# EAGLE design YM2151ShieldR3 (EAGLE 5.08)
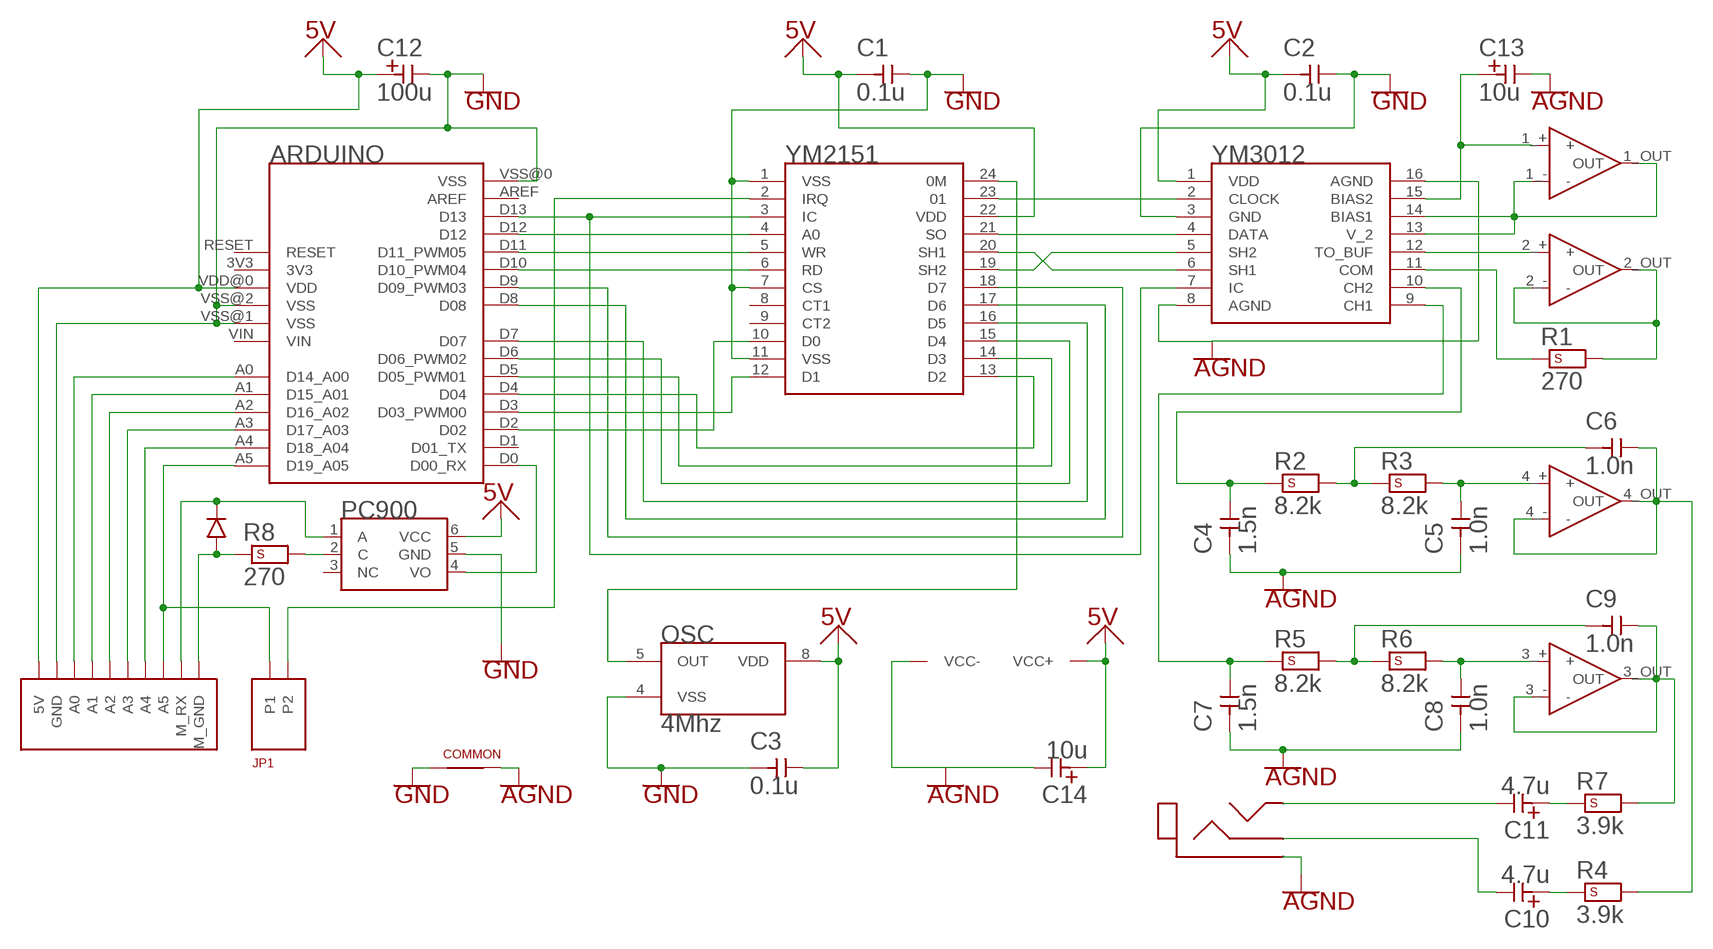
[diagram p0: schematic, sheet 1]

## Parts
ARDUINO  ARDUINO_DEV  [ARDUINO_PAC]
C1  0.1u  CAPACITOR_LEAD_DEV  [CAPACITOR_LEAD_PAC]
C2  0.1u  CAPACITOR_LEAD_DEV  [CAPACITOR_LEAD_PAC]
C3  0.1u  CAPACITOR_LEAD_DEV  [CAPACITOR_LEAD_PAC]
C4  1.5n  CAPACITOR_LEAD_DEV  [CAPACITOR_LEAD_PAC]
C5  1.0n  CAPACITOR_LEAD_DEV  [CAPACITOR_LEAD_PAC]
C6  1.0n  CAPACITOR_LEAD_DEV  [CAPACITOR_LEAD_PAC]
C7  1.5n  CAPACITOR_LEAD_DEV  [CAPACITOR_LEAD_PAC]
C8  1.0n  CAPACITOR_LEAD_DEV  [CAPACITOR_LEAD_PAC]
C9  1.0n  CAPACITOR_LEAD_DEV  [CAPACITOR_LEAD_PAC]
C10  4.7u  CAPACITOR_P_LEAD_DEV  [CAPACITOR_P_LEAD_PAC]
C11  4.7u  CAPACITOR_P_LEAD_DEV  [CAPACITOR_P_LEAD_PAC]
C12  100u  CAPACITOR_P_2MM_LEAD_DEV  [CAPACITOR_P_2MM_LEAD_PAC]
C13  10u  CAPACITOR_P_2MM_LEAD_DEV  [CAPACITOR_P_2MM_LEAD_PAC]
C14  10u  CAPACITOR_P_2MM_LEAD_DEV  [CAPACITOR_P_2MM_LEAD_PAC]
JP1  2PHEADER_DEV  [2PHEADER_PAC]
OPAMP  OPAMP4_DEV  [OPAMP4_PAC]
OSC  4Mhz  OSC_DEV  [OSC_PAC]
PC900  PC900V_DEV  [PC900V_PAC]
R1  270  RESISTER_V_SML_LEAD_DEV  [RESISTER_V_SML_LEAD_PAC]
R2  8.2k  RESISTER_V_SML_LEAD_DEV  [RESISTER_V_SML_LEAD_PAC]
R3  8.2k  RESISTER_V_SML_LEAD_DEV  [RESISTER_V_SML_LEAD_PAC]
R4  3.9k  RESISTER_V_SML_LEAD_DEV  [RESISTER_V_SML_LEAD_PAC]
R5  8.2k  RESISTER_V_SML_LEAD_DEV  [RESISTER_V_SML_LEAD_PAC]
R6  8.2k  RESISTER_V_SML_LEAD_DEV  [RESISTER_V_SML_LEAD_PAC]
R7  3.9k  RESISTER_V_SML_LEAD_DEV  [RESISTER_V_SML_LEAD_PAC]
R8  270  RESISTER_V_SML_LEAD_DEV  [RESISTER_V_SML_LEAD_PAC]
U$5  10PHEADER_DEV  [10PHEADER_PAC]
U$8  1S1588_DEV  [1S1588_PAC]
U$13  BTMBRIDGE_DEV  [BTMBRIDGE_PAC]
U$21  MINI_SW_DEV  [MINI_SW_PAC]
YM2151  YM2151DEV  [YM2151PAC]
YM3012  YM3012_DEV  [YM3012_PAC]

## Nets
5V [5V]: ARDUINO.VDD@0(VDD) C1.P$1 C2.P$1 C3.P$2 C12.P C14.P OPAMP.VCC+ OSC.8(VDD) PC900.6(VCC) U$5.P$1(5V) YM2151.22(VDD) YM3012.1(VDD)
AGND [AGND]: C4.P$1 C5.P$1 C7.P$1 C8.P$1 C13.N C14.N OPAMP.VCC- U$13.P$2 U$21.1(AGND) YM3012.8(AGND) YM3012.16(AGND)
GND [GND]: ARDUINO.VSS@0(VSS) ARDUINO.VSS@1(VSS) ARDUINO.VSS@2(VSS) C1.P$2 C2.P$2 C3.P$1 C12.N OSC.4(VSS) PC900.5(GND) U$5.P$2(GND) U$13.P$1 YM2151.1(VSS) YM2151.7(CS) YM2151.11(VSS) YM3012.3(GND)
M_GND: R8.P$1 U$5.P$10(M_GND) U$8.P$1
N$1: ARDUINO.D3(D03_PWM00) YM2151.12(D1)
N$2: ARDUINO.D2(D02) YM2151.10(D0)
N$3: ARDUINO.D4(D04) YM2151.13(D2)
N$4: ARDUINO.D5(D05_PWM01) YM2151.14(D3)
N$5: ARDUINO.D6(D06_PWM02) YM2151.15(D4)
N$6: ARDUINO.D7(D07) YM2151.16(D5)
N$7: ARDUINO.D8(D08) YM2151.17(D6)
N$8: ARDUINO.D9(D09_PWM03) YM2151.18(D7)
N$9: ARDUINO.D10(D10_PWM04) YM2151.6(RD)
N$10: ARDUINO.D11(D11_PWM05) YM2151.5(WR)
N$11: ARDUINO.D12 YM2151.4(A0)
N$12: ARDUINO.D13 YM2151.3(IC) YM3012.7(IC)
N$13: YM2151.20(SH1) YM3012.6(SH1)
N$14: YM2151.19(SH2) YM3012.5(SH2)
N$15: YM2151.21(SO) YM3012.4(DATA)
N$16: YM2151.23 YM3012.2(CLOCK)
N$17: ARDUINO.A5(D19_A05) JP1.1 U$5.P$8(A5)
N$18: ARDUINO.A4(D18_A04) U$5.P$7(A4)
N$19: ARDUINO.A3(D17_A03) U$5.P$6(A3)
N$20: ARDUINO.A2(D16_A02) U$5.P$5(A2)
N$21: ARDUINO.A1(D15_A01) U$5.P$4(A1)
N$22: ARDUINO.A0(D14_A00) U$5.P$3(A0)
N$23: JP1.2 YM2151.2(IRQ)
N$24: PC900.2(C) R8.P$2
N$25: PC900.1(A) U$5.P$9(M_RX) U$8.P$2
N$26: ARDUINO.D0(D00_RX) PC900.4(VO)
N$27 [5V]: C13.P OPAMP.1_+(+) YM3012.15(BIAS2)
N$28 [5V]: C7.P$2 R5.P$1 YM3012.9(CH1)
N$29 [5V]: OPAMP.1_-(-) OPAMP.1_OUT(OUT) YM3012.13(V_2) YM3012.14(BIAS1)
N$30 [5V]: R1.P$1 YM3012.11(COM)
N$31 [5V]: OPAMP.2_+(+) YM3012.12(TO_BUF)
N$32 [5V]: OPAMP.2_-(-) OPAMP.2_OUT(OUT) R1.P$2
N$33 [5V]: C4.P$2 R2.P$1 YM3012.10(CH2)
N$34: C9.P$2 OPAMP.3_-(-) OPAMP.3_OUT(OUT) R7.P$2
N$35 [5V]: C11.P R7.P$1
N$36 [5V]: C6.P$1 R2.P$2 R3.P$1
N$37 [5V]: C9.P$1 R5.P$2 R6.P$1
N$38 [5V]: C8.P$2 OPAMP.3_+(+) R6.P$2
N$39 [5V]: C10.N U$21.2(R)
N$40 [5V]: C5.P$2 OPAMP.4_+(+) R3.P$2
N$41 [5V]: C11.N U$21.5(L)
N$42 [5V]: OSC.5(OUT) YM2151.24(0M)
N$43 [5V]: C10.P R4.P$1
N$44 [5V]: C6.P$2 OPAMP.4_-(-) OPAMP.4_OUT(OUT) R4.P$2
Unconnected: ARDUINO.AREF ARDUINO.D1(D01_TX) ARDUINO.RESET ARDUINO.VIN PC900.3(NC) YM2151.8(CT1) YM2151.9(CT2)

## Power pins joined to a net without a drawn wire
3V3: ARDUINO.3V3

## Library data of the parts
ARDUINO = arduino:ARDUINO_DEV
C1-C9 = CAPACITOR_LEAD:CAPACITOR_LEAD_DEV
C10 C11 = CAPACITOR_P_LEAD:CAPACITOR_P_LEAD_DEV
C12-C14 = CAPACITOR_P_LEAD:CAPACITOR_P_2MM_LEAD_DEV
JP1 = PINHEADER:2PHEADER_DEV
OPAMP = OPAMP:OPAMP4_DEV
OSC = OSC_HALF:OSC_DEV
PC900 = Photocoupler:PC900V_DEV
R1-R8 = RESISTER_H_LEAD:RESISTER_V_SML_LEAD_DEV
U$5 = PINHEADER:10PHEADER_DEV
U$8 = Diode:1S1588_DEV
U$13 = POWER:BTMBRIDGE_DEV
U$21 = MINI_SW:MINI_SW_DEV
YM2151 = YM2151:YM2151DEV
YM3012 = YM3012:YM3012_DEV

## Board
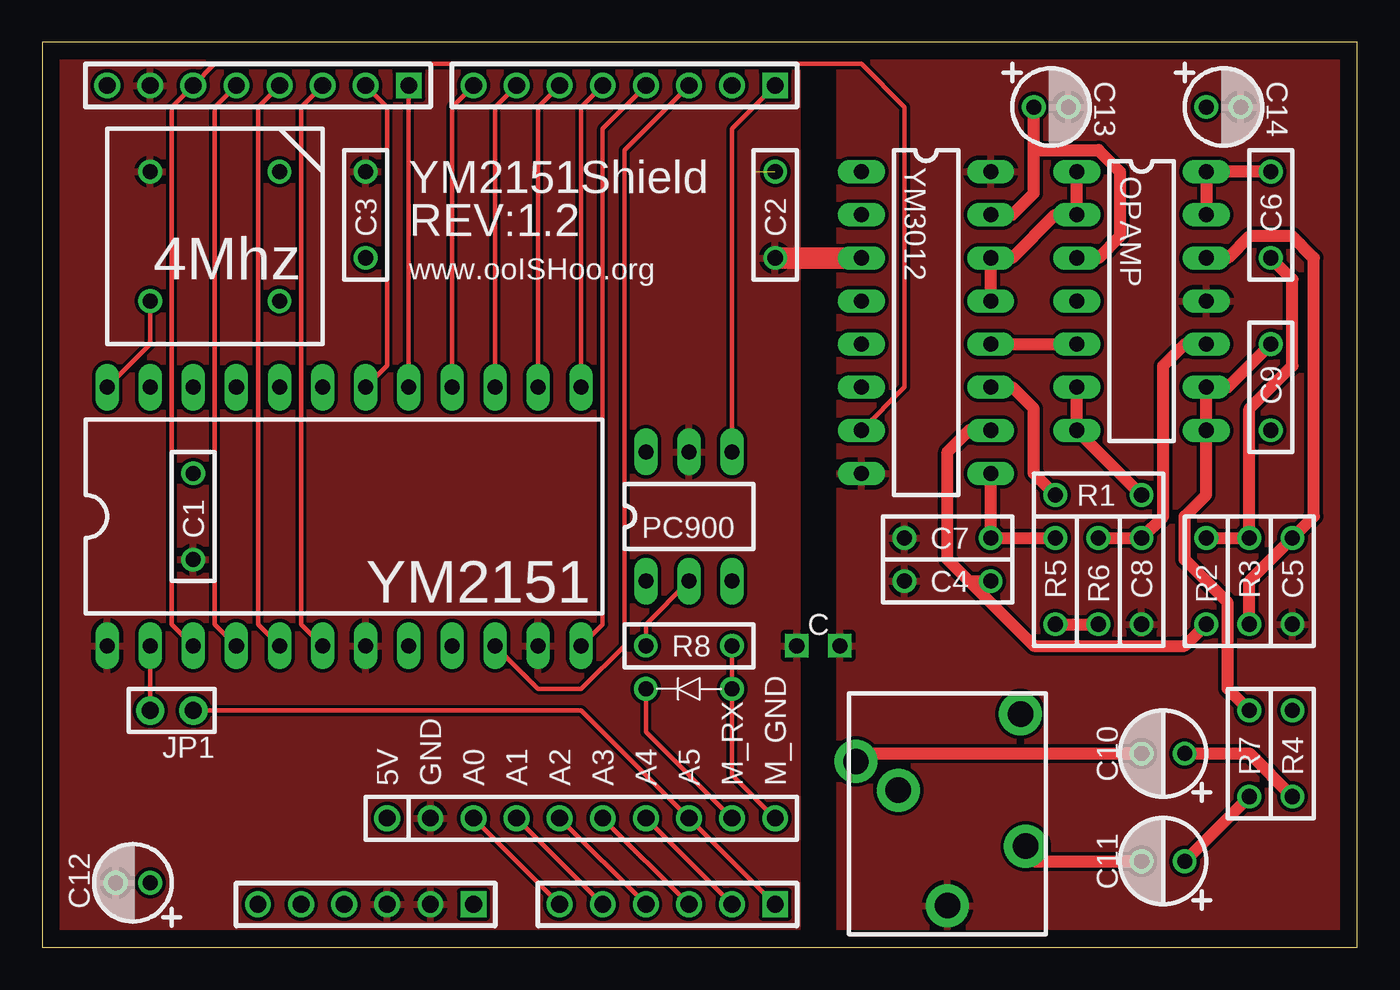
[diagram p1: board, top side]
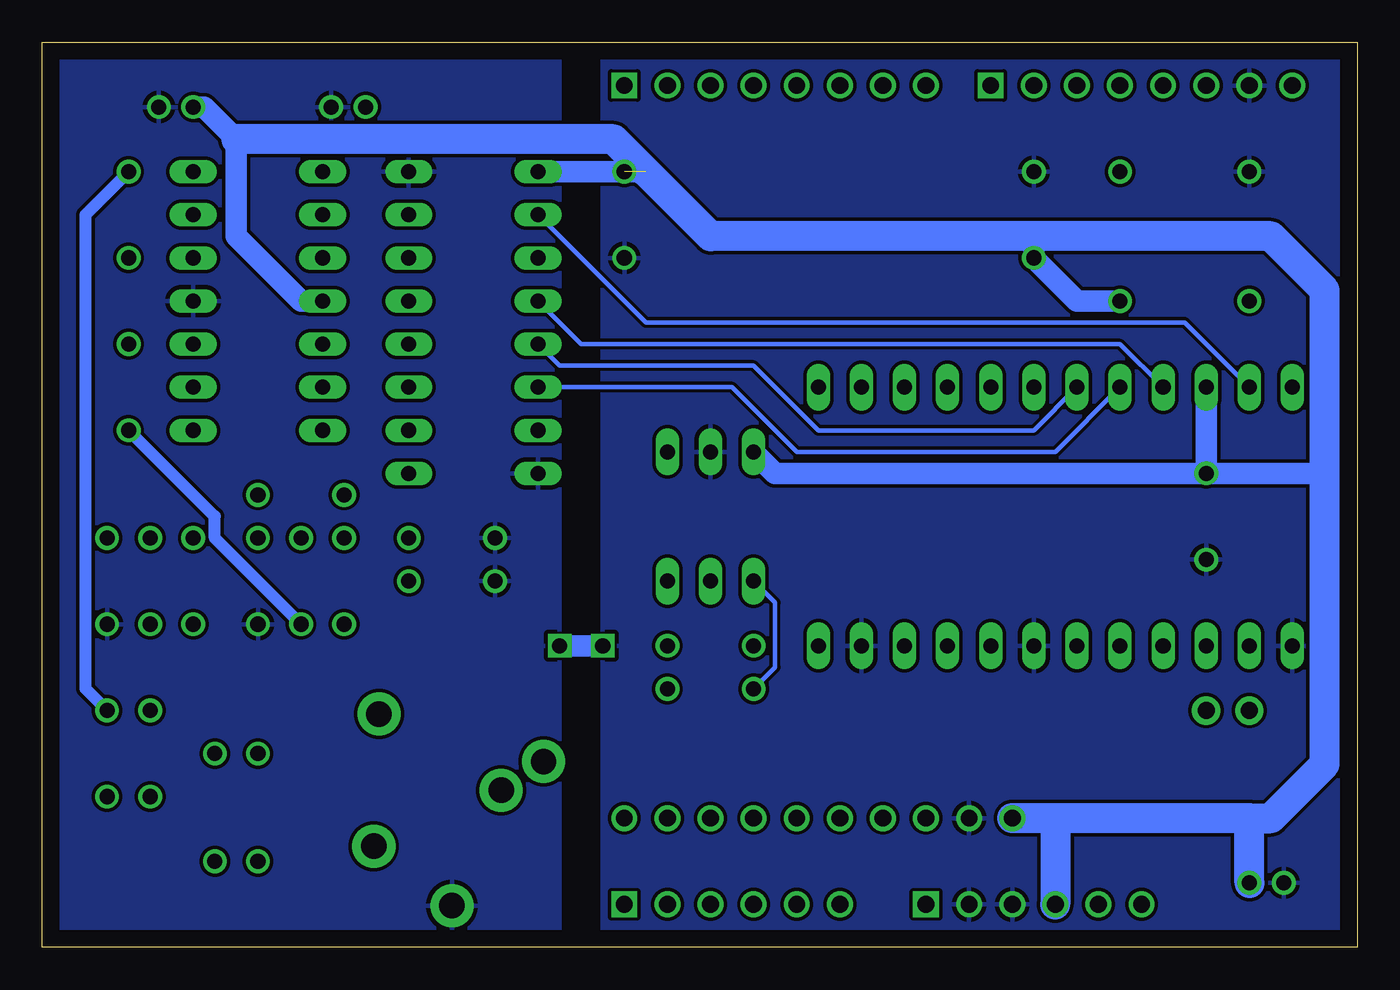
[diagram p2: board, bottom side, seen from below]

Size 77.47 x 53.34 mm. Coordinates in mm from the lower left corner, seen from the top.
Outline: 0,0 77.47,0 77.47,53.34 0,53.34 0,0
Copper layers (1*16): Top 0.035mm / dielectric 1.5mm / Bottom 0.035mm
Design rules "default": minimum track width 10mil, minimum drill 24mil, track to track 8mil, track to pad 8mil, pad to pad 8mil, via to via 8mil, smd to smd 8mil, copper to edge 40mil, drill to drill 8mil, minimum pad ring 10mil, minimum via ring 8mil, stop-mask expansion 4mil, vias tented up to drill 0mil, thermal gap 10mil

### Footprints (pad centres in the part's own frame; a part is rotated, then mirrored left to right if it is on the bottom)
ARDUINO_PAC = drill 0.991 pad 1.524 round: 3V3 -48.26,-15.24; A0 -48.26,-30.48; A1 -48.26,-33.02; A2 -48.26,-35.56; A3 -48.26,-38.1; A4 -48.26,-40.64; AREF 0,-3.81; D1 0,-40.64; D2 0,-38.1; D3 0,-35.56; D4 0,-33.02; D5 0,-30.48; D6 0,-27.94; D7 0,-25.4; D9 0,-19.05; D10 0,-16.51; D11 0,-13.97; D12 0,-11.43; D13 0,-8.89; RESET -48.26,-12.7; VDD@0 -48.26,-17.78; VSS@0 0,-6.35; VSS@1 -48.26,-22.86; VSS@2 -48.26,-20.32 | drill 0.991 pad 1.524 square: A5 -48.26,-43.18; D0 0,-43.18; D8 0,-21.59; VIN -48.26,-25.4
CAPACITOR_LEAD_PAC = drill 0.889 pad 1.372 round: P$1 1.27,-1.27; P$2 6.35,-1.27
CAPACITOR_P_LEAD_PAC = drill 0.889 pad 1.372 round: N 0,0; P -2.54,0
CAPACITOR_P_2MM_LEAD_PAC = drill 0.889 pad 1.372 round: N 2.032,0; P 0,0
2PHEADER_PAC = drill 0.991 pad 1.676 round: 1 0,0; 2 2.54,0
OPAMP4_PAC = drill 0.889 pad 1.372 long: 1_+ 0,-7.62; 1_- 0,-5.08; 1_OUT 0,-2.54; 2_+ 0,-12.7; 2_- 0,-15.24; 2_OUT 0,-17.78; 3_+ 7.62,-12.7; 3_- 7.62,-15.24; 3_OUT 7.62,-17.78; 4_+ 7.62,-7.62; 4_- 7.62,-5.08; 4_OUT 7.62,-2.54; VCC+ 0,-10.16; VCC- 7.62,-10.16
OSC_PAC = drill 0.889 pad 1.372 round: 1 2.54,0; 4 10.16,0; 5 10.16,7.62; 8 2.54,7.62
PC900V_PAC = drill 0.889 pad 1.372 long: 1 -3.81,2.54; 2 -3.81,0; 3 -3.81,-2.54; 4 3.81,-2.54; 5 3.81,0; 6 3.81,2.54
RESISTER_V_SML_LEAD_PAC = drill 0.889 pad 1.372 round: P$1 2.54,0; P$2 -2.54,0
10PHEADER_PAC = drill 0.991 pad 1.524 round: P$1 2.54,0; P$2 5.08,0; P$3 7.62,0; P$4 10.16,0; P$5 12.7,0; P$6 15.24,0; P$7 17.78,0; P$8 20.32,0; P$9 22.86,0; P$10 25.4,0
1S1588_PAC = drill 0.889 pad 1.372 round: P$1 -2.54,0; P$2 2.54,0
BTMBRIDGE_PAC = drill 0.889 pad 1.372 square: P$1 -1.27,0; P$2 1.27,0
MINI_SW_PAC = drill 1.5 pad 2.54 round: 1 -2.97,-6.35; 2 -11.47,-11.75; 3 -9.77,-9.25; 4 -14.27,-2.05; 5 -6.47,-1.75
YM2151PAC = drill 0.889 pad 1.372 long: 1 0,-2.54; 2 0,-5.08; 3 0,-7.62; 4 0,-10.16; 5 0,-12.7; 6 0,-15.24; 7 0,-17.78; 8 0,-20.32; 9 0,-22.86; 10 0,-25.4; 11 0,-27.94; 12 0,-30.48; 13 15.24,-30.48; 14 15.24,-27.94; 15 15.24,-25.4; 16 15.24,-22.86; 17 15.24,-20.32; 18 15.24,-17.78; 19 15.24,-15.24; 20 15.24,-12.7; 21 15.24,-10.16; 22 15.24,-7.62; 23 15.24,-5.08; 24 15.24,-2.54
YM3012_PAC = drill 0.889 pad 1.372 long: 1 0,-2.54; 2 0,-5.08; 3 0,-7.62; 4 0,-10.16; 5 0,-12.7; 6 0,-15.24; 7 0,-17.78; 8 0,-20.32; 9 7.62,-20.32; 10 7.62,-17.78; 11 7.62,-15.24; 12 7.62,-12.7; 13 7.62,-10.16; 14 7.62,-7.62; 15 7.62,-5.08; 16 7.62,-2.54

### Placement (x,y rotation side)
ARDUINO  0,50.8 90 top
C1  10.16,29.21 270 top
C2  44.45,46.99 270 top
C3  20.32,46.99 270 top
C4  49.53,22.86 0 top
C5  72.39,17.78 90 top
C6  71.12,39.37 90 top
C7  49.53,25.4 0 top
C8  63.5,17.78 90 top
C9  71.12,29.21 90 top
C10  64.77,11.43 180 top
C11  64.77,5.08 180 top
C12  6.35,3.81 180 top
C13  58.42,49.53 0 top
C14  68.58,49.53 0 top
JP1  8.89,13.97 180 top
OPAMP  60.96,48.26 0 top
OSC  16.51,45.72 180 top
PC900  38.1,25.4 90 top
R1  62.23,26.67 180 top
R2  68.58,21.59 270 top
R3  71.12,21.59 90 top
R4  73.66,11.43 270 top
R5  59.69,21.59 90 top
R6  62.23,21.59 270 top
R7  71.12,11.43 270 top
R8  38.1,17.78 0 top
U$5  17.78,7.62 0 top
U$8  38.1,15.24 180 top
U$13  45.72,17.78 0 top
U$21  59.69,-0.51 270 top
YM2151  1.27,17.78 90 top
YM3012  48.26,48.26 0 top

### Tracks (layer width: path | path; a pad name or v marks a point on that pad's centre or on a via)
5V  (1 unrouted)
  Bottom 1.27: OPAMP.VCC+ 62.23,38.1 66.04,41.91 66.04,47.62 67.94,49.53 C14.P | 41.91,45.72 YM3012.1 | OSC.8 16.51,38.1 C3.P$2 19.05,41.91 | PC900.6 34.29,27.94 C1.P$1 | C1.P$1 YM2151.22 | 1.91,27.94 C1.P$1
  Bottom 1.778: 66.04,47.62 43.81,47.62 41.91,45.72 38.1,41.91 19.05,41.91 5.08,41.91 1.91,38.73 1.91,27.94 1.91,10.79 5.08,7.62 6.35,7.62 | 17.78,7.62 U$5.P$1 | 17.78,7.62 ARDUINO.VDD@0 | 6.35,7.62 17.78,7.62 | C12.P 6.35,7.62
AGND
  pour Top: 46.99,53.34 77.47,53.34 77.47,0 46.99,0
  pour Bottom: 46.99,53.34 77.47,53.34 77.47,0 46.99,0
GND
  Top 1.27: C2.P$2 YM3012.3
  pour Top: 0,53.34 44.45,53.34 44.45,0 0,0
  pour Bottom: 0,53.34 44.45,53.34 44.45,0 0,0
M_GND
  Top 0.254: R8.P$1 U$8.P$1 40.64,10.16 U$5.P$10
N$1
  Top 0.254: YM2151.12 33.02,19.05 33.02,48.26 ARDUINO.D3
N$2
  Top 0.254: YM2151.10 29.21,15.24 31.75,15.24 34.29,17.78 34.29,46.99 ARDUINO.D2
N$3
  Top 0.254: YM2151.13 31.75,49.53 ARDUINO.D4
N$4
  Top 0.254: YM2151.14 29.21,49.53 ARDUINO.D5
N$5
  Top 0.254: YM2151.15 26.67,49.53 ARDUINO.D6
N$6
  Top 0.254: YM2151.16 24.13,49.53 ARDUINO.D7
N$7
  Top 0.254: YM2151.17 ARDUINO.D8
N$8
  Top 0.254: ARDUINO.D9 20.32,49.53 20.32,34.29 YM2151.18
N$9
  Top 0.254: YM2151.6 15.24,19.05 15.24,49.53 ARDUINO.D10
N$10
  Top 0.254: YM2151.5 12.7,19.05 12.7,49.53 ARDUINO.D11
N$11
  Top 0.254: YM2151.4 10.16,19.05 10.16,49.53 ARDUINO.D12
N$12
  Top 0.254: YM2151.3 7.62,19.05 7.62,49.53 ARDUINO.D13 10.16,52.07 48.26,52.07 50.8,49.53 50.8,33.02 YM3012.7
N$13
  Bottom 0.254: YM2151.20 17.78,29.21 33.02,29.21 36.83,33.02 YM3012.6
N$14
  Bottom 0.254: YM2151.19 19.05,30.48 31.75,30.48 35.56,34.29 46.99,34.29 YM3012.5
N$15
  Bottom 0.254: YM2151.21 13.97,35.56 45.72,35.56 YM3012.4
N$16
  Bottom 0.254: YM3012.2 41.91,36.83 10.16,36.83 YM2151.23
N$17
  Top 0.254: ARDUINO.A5 U$5.P$8 31.75,13.97 JP1.1
N$18
  Top 0.254: ARDUINO.A4 U$5.P$7
N$19
  Top 0.254: ARDUINO.A3 U$5.P$6
N$20
  Top 0.254: ARDUINO.A2 U$5.P$5
N$21
  Top 0.254: ARDUINO.A1 U$5.P$4
N$22
  Top 0.254: ARDUINO.A0 U$5.P$3
N$23
  Top 0.254: JP1.2 YM2151.2
N$24
  Top 0.254: R8.P$2 35.56,19.05 PC900.2
N$25
  Top 0.254: U$5.P$9 35.56,12.7 U$8.P$2
  Bottom 0.254: U$8.P$2 34.29,16.51 34.29,20.32 PC900.1
N$26
  Top 0.254: PC900.4 40.64,48.26 ARDUINO.D0
N$27
  Top 0.711: YM3012.15 57.15,43.18 58.42,44.45 58.42,46.99 | 58.42,46.99 C13.P | 58.42,46.99 62.23,46.99 63.5,45.72 63.5,41.91 62.23,40.64 OPAMP.1_+
N$28
  Top 0.711: YM3012.9 C7.P$2 R5.P$1
N$29
  Top 0.711: OPAMP.1_OUT OPAMP.1_- 59.69,43.18 57.15,40.64 YM3012.14 YM3012.13
N$30
  Top 0.711: YM3012.11 57.15,33.02 58.42,31.75 58.42,27.94 R1.P$1
N$31
  Top 0.711: YM3012.12 OPAMP.2_+
N$32
  Top 0.711: OPAMP.2_- OPAMP.2_OUT R1.P$2
N$33
  Top 0.711: YM3012.10 54.61,30.48 53.34,29.21 53.34,22.86 54.61,21.59 | 54.61,21.59 58.42,17.78 67.31,17.78 R2.P$1 | 54.61,21.59 C4.P$2
N$34
  Top 0.711: C9.P$2 69.85,33.02 OPAMP.3_- OPAMP.3_OUT 68.58,26.67 67.31,25.4 67.31,22.86 69.85,20.32 69.85,15.24 R7.P$2
N$35
  Top 0.711: C11.P R7.P$1
N$36
  Top 0.711: R2.P$2 R3.P$1 71.12,31.75 73.66,34.29 73.66,39.37 C6.P$1
N$37
  Top 0.711: R5.P$2 R6.P$1
  Bottom 0.711: R6.P$1 67.31,24.13 67.31,25.4 C9.P$1
N$38
  Top 0.711: R6.P$2 C8.P$2 66.04,25.4 66.04,34.29 67.31,35.56 OPAMP.3_+
N$39
  Top 0.254: U$21.2 48.26,11.43
  Top 0.711: 48.26,11.43 C10.N
N$40
  Top 0.711: OPAMP.4_+ 69.85,40.64 71.12,41.91 73.66,41.91 74.93,40.64 74.93,25.4 C5.P$2 71.12,21.59 R3.P$2
N$41
  Top 0.254: U$21.5 58.42,5.08
  Top 0.711: 58.42,5.08 C11.N
N$42
  Top 0.254: YM2151.24 6.35,35.56 OSC.5
N$43
  Top 0.711: R4.P$1 71.12,11.43 C10.P
N$44
  Top 0.711: OPAMP.4_- OPAMP.4_OUT C6.P$2
  Bottom 0.711: C6.P$2 74.93,43.18 74.93,15.24 R4.P$2

### Text on the board
tPlace: YM2151Shield | REV:1.2 | www.ooISHoo.org